# EAGLE design encoder_step2 (EAGLE 7.6.0)
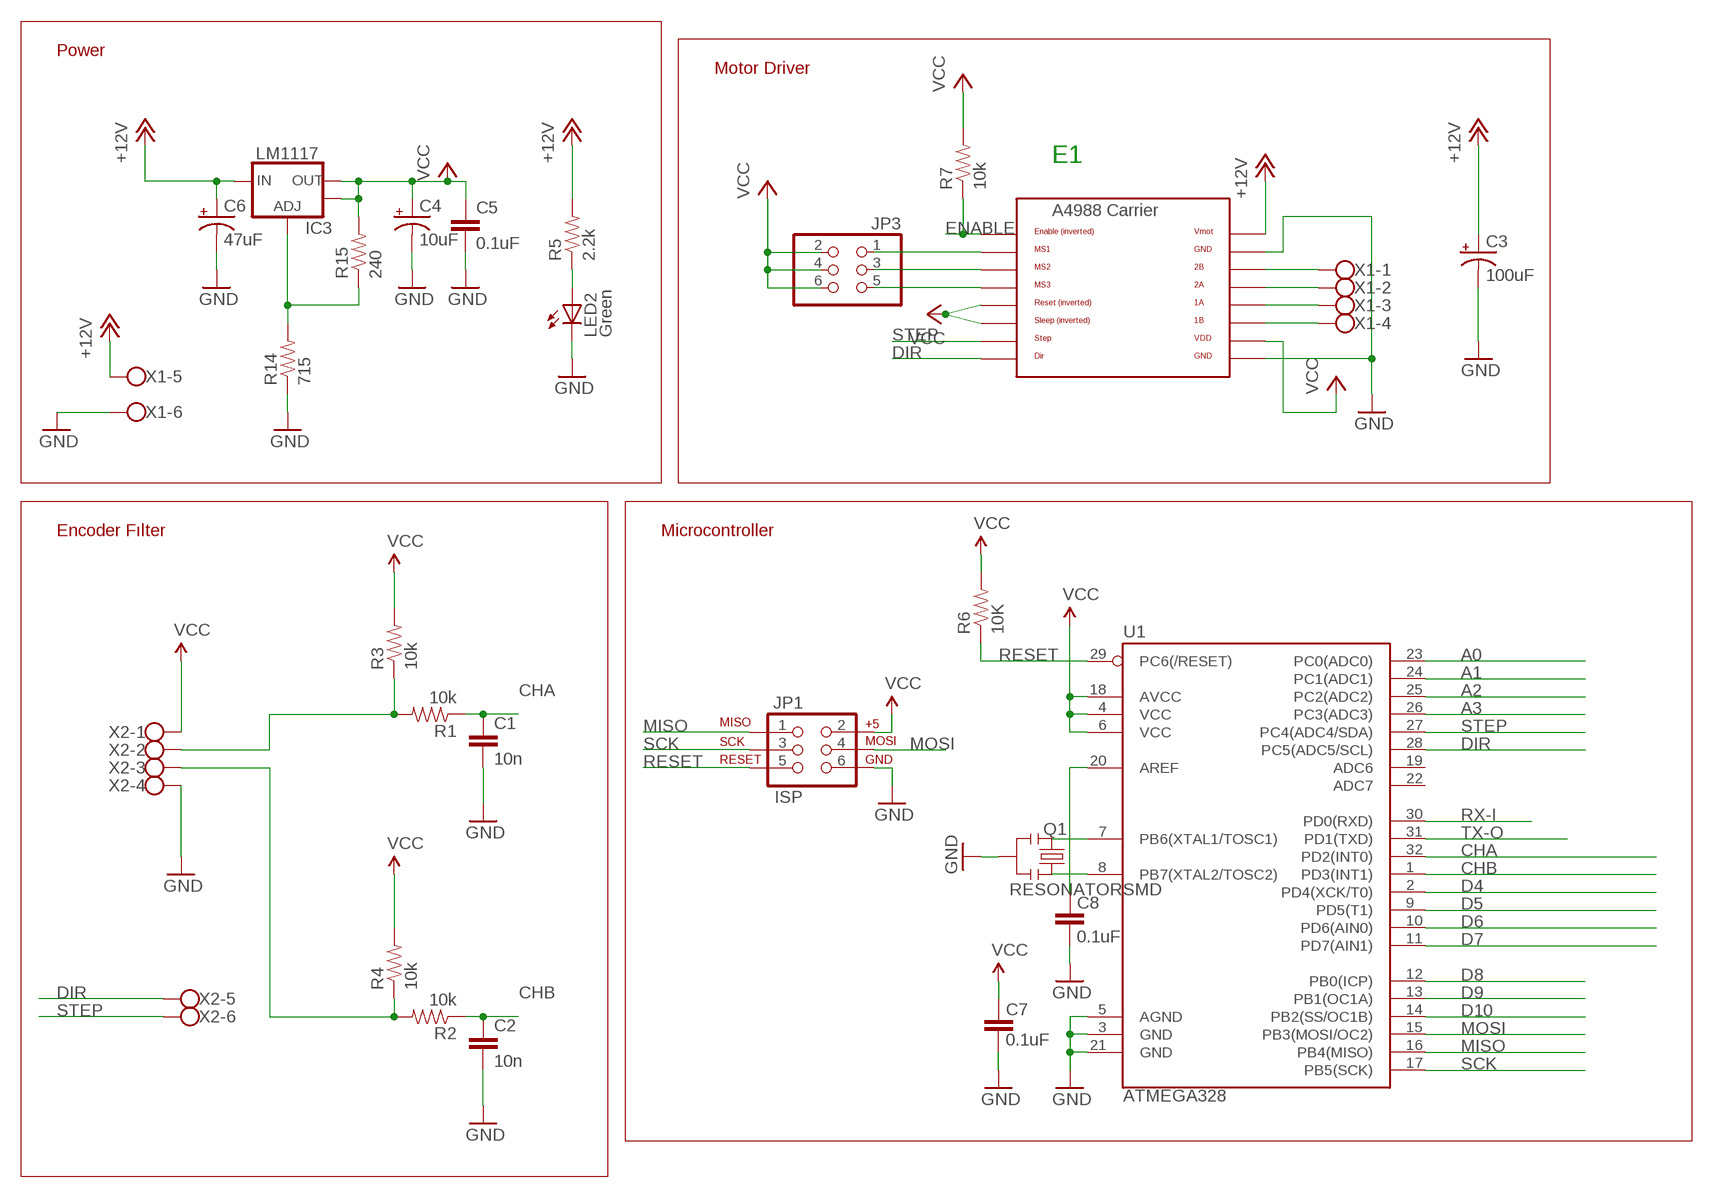
[diagram p0: schematic, sheet 1]

## Parts
C1  10n  2.2UF-25V-+80/-20(0805)  [0805]
C2  10n  2.2UF-25V-+80/-20(0805)  [0805]
C3  100uF  CPOL-US153CLV-0605  [153CLV-0605]
C4  10uF  CAP_POL1206  [EIA3216]
C5  0.1uF  CAP0805  [0805]
C6  47uF  CAP_POLD  [PANASONIC_D]
C7  0.1uF  CAP0805  [0805]
C8  0.1uF  CAP0805  [0805]
IC3  LM1117  V_REG_LM1117ALT1  [SOT223-ALT1]
JP1  ISP  AVR_SPI_PRG_6PTH  [2X3]
JP3  PINHD-2X3  [2X03]
LED2  Green  LED1206-NS  [LED-1206-NO_SILK]
Q1  RESONATORSMD  [RESONATOR-SMD]
R1  10k  RESISTOR0805-RES  [0805]
R2  10k  RESISTOR0805-RES  [0805]
R3  10k  RESISTOR0805-RES  [0805]
R4  10k  RESISTOR0805-RES  [0805]
R5  2.2k  RESISTOR0805-RES  [0805]
R6  10K  RESISTOR0805-RES  [0805]
R7  10k  RESISTOR0805-RES  [0805]
R14  715  RESISTOR0805-RES  [0805]
R15  240  RESISTOR0805-RES  [0805]
U1  ATMEGA328  ATMEGA168  [TQFP32-08]
U$5  A4988BREAKOUT  [A4988BREAKOUT]
X1  W237-6  [W237-6]
X2  W237-6  [W237-6]

## Nets
+12V [motors]: C3.+ C6.+ IC3.3(IN) R5.2 U$5.VMOT X1.5
A0: U1.23(PC0(ADC0))
A1: U1.24(PC1(ADC1))
A2: U1.25(PC2(ADC2))
A3: U1.26(PC3(ADC3))
AREF: C8.2 U1.20(AREF)
CHA: C1.1 R1.1 U1.32(PD2(INT0))
CHB: C2.1 R2.1 U1.1(PD3(INT1))
D4: U1.2(PD4(XCK/T0))
D5: U1.9(PD5(T1))
D6: U1.10(PD6(AIN0))
D7: U1.11(PD7(AIN1))
D8: U1.12(PB0(ICP))
D9: U1.13(PB1(OC1A))
D10: U1.14(PB2(SS/OC1B))
DIR: U1.28(PC5(ADC5/SCL)) U$5.DIR X2.5
ENABLE: R7.1 U$5.EN
GND: C1.2 C2.2 C3.- C4.C(-) C5.2 C6.- C7.1 C8.1 JP1.6 LED2.C Q1.2 R14.1 U1.3(GND) U1.5(AGND) U1.21(GND) U$5.GND U$5.GND@0(GND) X1.6 X2.4
MISO: JP1.1 U1.16(PB4(MISO))
MOSI: JP1.4 U1.15(PB3(MOSI/OC2))
N$1: Q1.1 U1.8(PB7(XTAL2/TOSC2))
N$2: LED2.A R5.1
N$3: R1.2 R3.1 X2.2
N$4: R2.2 R4.1 X2.3
N$5: Q1.3 U1.7(PB6(XTAL1/TOSC1))
N$12 [motors]: U$5.2B X1.1
N$13 [motors]: U$5.2A X1.2
N$15: IC3.1(ADJ) R14.2 R15.1
N$16 [motors]: U$5.1A X1.3
N$18 [motors]: U$5.1B X1.4
N$25: JP3.1 U$5.MS1
N$34: JP3.5 U$5.MS3
N$35: JP3.3 U$5.MS2
RESET: JP1.5 R6.1 U1.29(PC6(/RESET))
RX-I: U1.30(PD0(RXD))
SCK: JP1.3 U1.17(PB5(SCK))
STEP: U1.27(PC4(ADC4/SDA)) U$5.STEP X2.6
TX-O: U1.31(PD1(TXD))
VCC: C4.A(+) C5.1 C7.2 IC3.2(OUT) IC3.4(OUT) JP1.2 JP3.2 JP3.4 JP3.6 R3.2 R4.2 R6.2 R7.2 R15.2 U1.4(VCC) U1.6(VCC) U1.18(AVCC) U$5.RST U$5.SLP(SLEEP) U$5.VDD X2.1
Unconnected: U1.19(ADC6) U1.22(ADC7)

## Notes on the sheet
- Power
- Motor Driver
- E1
- Encoder Fılter | Microcontroller

## Library data of the parts
C1 C2 = SparkFun-Capacitors:2.2UF-25V-+80/-20(0805): CAP-11624; PROD_ID: CAP-11624; VALUE: 2.2uF
C3 = adafruit:CPOL-US: POLARIZED CAPACITOR, American symbol
C4 C6 = SparkFun:CAP_POL: Capacitor Polarized These are standard SMD and PTH capacitors. Normally 10uF, 47uF, and 100uF in electrolytic and tantalum varieties. Always verify the external diameter of the through hole cap, it varies with capacity, voltage, and manufacturer. The EIA devices should be standard.
C5 C7 C8 = SparkFun:CAP: Capacitor Standard 0603 ceramic capacitor, and 0.1" leaded capacitor.
IC3 = Testing:V_REG_LM1117: Voltage Regulator LM1117 Standard adjustable voltage regulator but in SMD form. Spark Fun Electronics SKU : COM-00595
JP1 = SparkFun:AVR_SPI_PRG_6: AVR ISP 6 Pin This is the reduced ISP connector for AVR programming. Common on Arduino. This footprint will take up less PCB space and can be used with a 10-pin to 6-pin adapter such as SKU: BOB-08508
JP3 = pinhead:PINHD-2X3: PIN HEADER
LED2 = SparkFun-LED:LED: LEDs Standard schematic elements and footprints for 5mm, 3mm, 1206, and 0603 sized LEDs. 5mm - Spark Fun Electronics SKU : COM-00529 (and others)
Q1 = SparkFun:RESONATOR: Resonator Small SMD resonator. This is the itty bitty 10/20MHz resonators with built in caps. CSTCE10M0G55 and CSTCE20M0V53. Footprint has been reviewed closely but hasn't been tested yet.
R1-R4 R7 = SparkFun-Passives:RESISTOR: Resistor Basic schematic elements and footprints for 0603, 1206, and PTH resistors.
R5 R6 R14 R15 = SparkFun:RESISTOR: Resistor Basic schematic elements and footprints for 0603, 1206, and PTH resistors.
U1 = SparkFun:ATMEGA168
U$5 = RepRapjr:A4988BREAKOUT
X1 X2 = con-wago-500:W237-6: WAGO SCREW CLAMP; OC_FARNELL: unknown; OC_NEWARK: unknown

## Net classes
0 default: width 0.152 mm, drill 0.305 mm, clearance 0.152 mm
1 vcc: width 0.254 mm
2 motors: width 1.016 mm

## Board
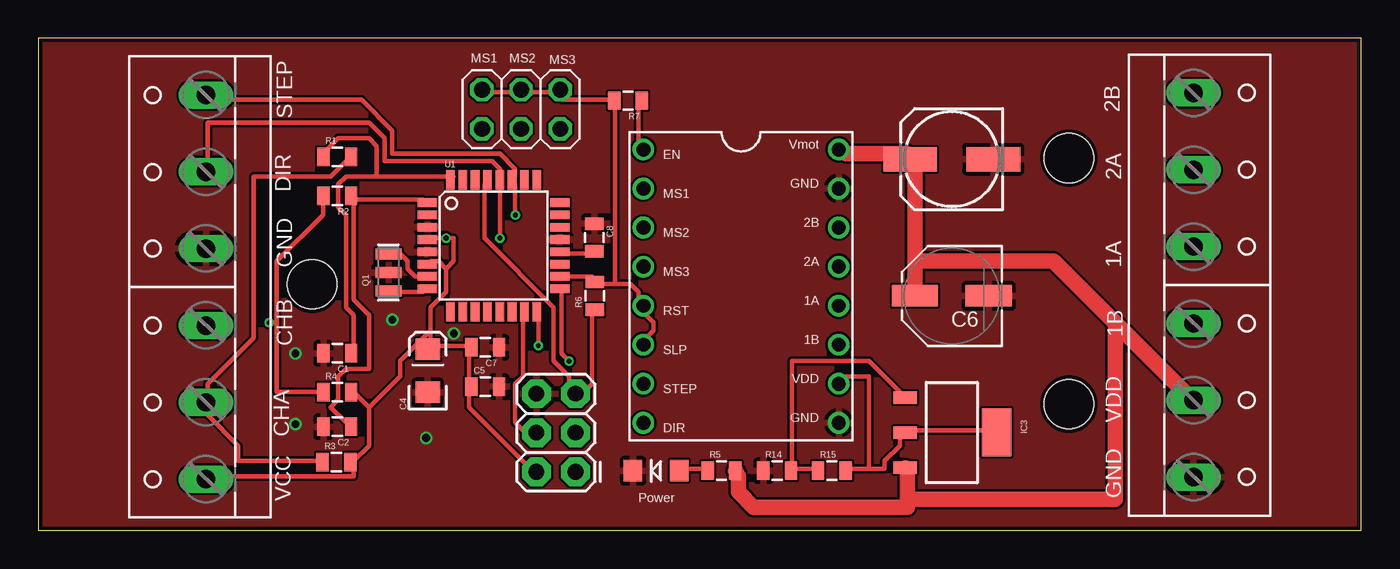
[diagram p1: board, top side]
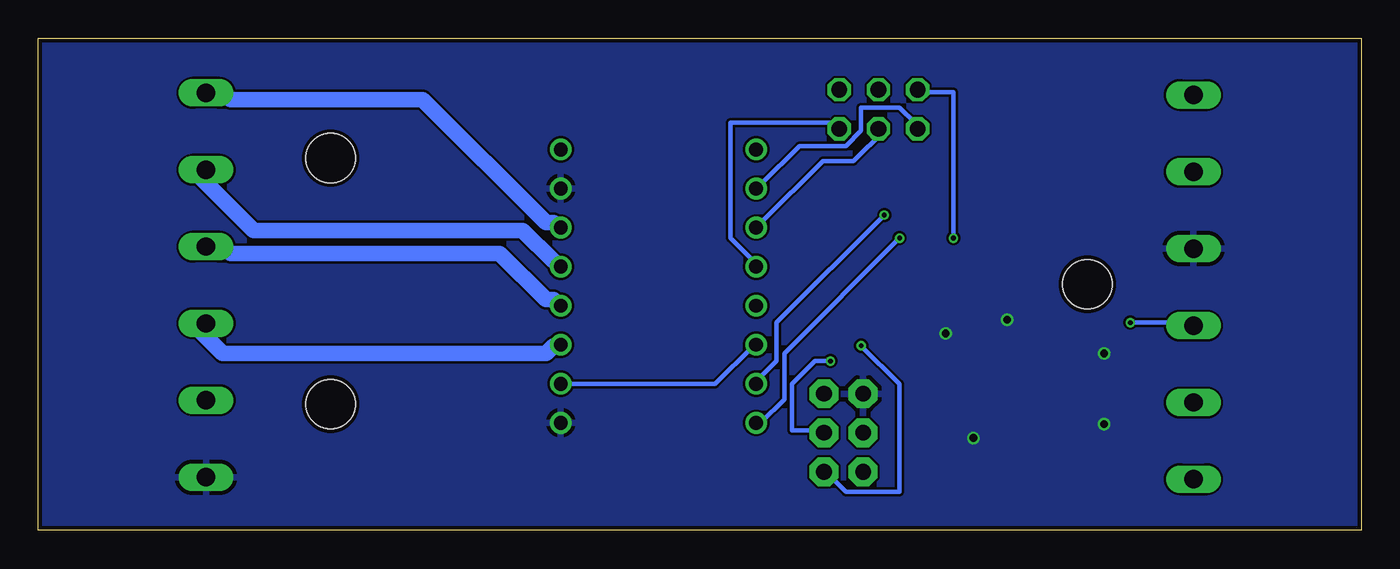
[diagram p2: board, bottom side, seen from below]

Size 85.99 x 31.99 mm. Coordinates in mm from the lower left corner, seen from the top.
Outline: 0,0 85.99,0 85.99,31.99 0,31.99 0,0
Copper layers (1*16): Top 0.035mm / dielectric 1.5mm / Bottom 0.035mm
Design rules: minimum track width 6mil, minimum drill 12mil, track to track 6mil, track to pad 6mil, pad to pad 6mil, via to via 6mil, smd to smd 0mil, copper to edge 10mil, drill to drill 10mil, minimum pad ring 10mil, minimum via ring 6mil, stop-mask expansion 2mil, vias tented up to drill 100mil, thermal gap 10mil
Holes 3.2 mm at 17.8,16 67,8.2 67,24.2

### Footprints (pad centres in the part's own frame; a part is rotated, then mirrored left to right if it is on the bottom)
0805 = smd 0.8 x 1.2: 1 -0.9,0; 2 0.9,0
153CLV-0605 = smd 3.5 x 1.6: + 2.7,0; - -2.7,0
EIA3216 = smd 1.4 x 1.6: A 1.4,0; C -1.4,0
PANASONIC_D = smd 3 x 1.4: + 2.4,0; - -2.4,0
SOT223-ALT1 = smd 0.813 x 1.524: 1 -2.271,-3.02; 2 0,-3.02; 3 2.288,-3.02 | smd 3.124 x 1.905: 4 0,2.921
2X3 = drill 1.016 pad 1.88 octagon: 1 0,0; 2 0,2.54; 3 2.54,0; 4 2.54,2.54; 5 5.08,0; 6 5.08,2.54
2X03 = drill 1.016 octagon: 1 -2.54,-1.27; 2 -2.54,1.27; 3 0,-1.27; 4 0,1.27; 5 2.54,-1.27; 6 2.54,1.27
LED-1206-NO_SILK = smd 1.2 x 1.4: A -1.5,0; C 1.5,0
RESONATOR-SMD = smd 0.7 x 1.7: 1 -1.2,0; 2 0,0; 3 1.2,0
TQFP32-08 = smd 1.27 x 0.559: 1 -4.293,2.8; 2 -4.293,2; 3 -4.293,1.2; 4 -4.293,0.4; 5 -4.293,-0.4; 6 -4.293,-1.2; 7 -4.293,-2; 8 -4.293,-2.8; 17 4.293,-2.8; 18 4.293,-2; 19 4.293,-1.2; 20 4.293,-0.4; 21 4.293,0.4; 22 4.293,1.2; 23 4.293,2; 24 4.293,2.8 | smd 0.559 x 1.27: 9 -2.8,-4.293; 10 -2,-4.293; 11 -1.2,-4.293; 12 -0.4,-4.293; 13 0.4,-4.293; 14 1.2,-4.293; 15 2,-4.293; 16 2.8,-4.293; 25 2.8,4.293; 26 2,4.293; 27 1.2,4.293; 28 0.4,4.293; 29 -0.4,4.293; 30 -1.2,4.293; 31 -2,4.293; 32 -2.8,4.293
A4988BREAKOUT = drill 0.9: 1A 8.89,1.27; 1B 11.43,1.27; 2A 6.35,1.27; 2B 3.81,1.27; DIR 16.51,-11.43; EN -1.27,-11.43; GND 16.51,1.27; GND@0 1.27,1.27; MS1 1.27,-11.43; MS2 3.81,-11.43; MS3 6.35,-11.43; RST 8.89,-11.43; SLP 11.43,-11.43; STEP 13.97,-11.43; VDD 13.97,1.27; VMOT -1.27,1.27
W237-6 = drill 1.194 long: 1 -12.5,-1.27; 2 -7.5,-1.27; 3 -2.5,-1.27; 4 2.5,-1.27; 5 7.5,-1.27; 6 12.5,-1.27

### Placement (x,y rotation side)
C1  19.43,11.51 180 top
C2  19.43,6.73 180 top
C3  59.38,24.13 180 top
C4  25.31,10.37 90 top
C5  29.05,9.35 0 top
C6  59.38,15.24 180 top
C7  29.05,11.89 180 top
C8  36.14,19.04 270 top
IC3  59.38,6.35 270 top
JP1  34.92,3.8 90 top
JP3  31.38,27.39 0 top
LED2  40.16,3.87 180 top
Q1  22.76,16.76 90 top
R1  19.43,24.29 0 top
R2  19.43,21.75 180 top
R3  19.37,4.43 0 top
R4  19.43,8.97 0 top
R5  44.41,3.87 0 top
R6  36.16,15.25 90 top
R7  38.33,27.94 180 top
R14  48.03,3.87 0 top
R15  51.59,3.87 0 top
U1  29.59,18.51 0 top
U$5  50.76,23.5 270 top
X1  76.37,15.95 270 top
X2  9.63,15.81 90 top

### Tracks (layer width: path | path; a pad name or v marks a point on that pad's centre or on a via)
+12V
  Top 1.016: 56.5,2 56.5,4 IC3.3 | 56.5,2 56.5,1.5 46.5,1.5 45.5,2.5 45.5,3.5 R5.2 | U$5.VMOT 52.5,24.5 56.5,24.5 C3.+ 57,24 57,17.5 | 57,17.5 57,15.5 C6.+ | 70.25,13.25 66,17.5 57,17.5 | 70.25,13.25 75,8.5 X1.5 | 56.5,2 70,2 70,13 70.25,13.25
AREF
  Top 0.305: C8.2 36,18 34,18 U1.20
CHA
  Top 0.305: 22,23 27,23 U1.32 | 22,23 20,23 19.5,22.5 19.5,21 20,20.5 20,14.5 20.5,14 20.5,12 C1.1 | 22,23 22,25 21.5,25.5 19.5,25.5 18.5,24.5 R1.1
CHB
  Top 0.305: 20.5,21.5 20.5,15 21.5,14 21.5,10.5 20,10.5 19.5,10 19.5,8.5 19,8 20,7 C2.1 | 20.5,21.5 25,21.5 U1.1 | 20.5,21.5 R2.1
DIR  (via drill 0.3)
  Top 0.305: X2.5 11,23.5 11,26.5 21.5,26.5 22.5,25.5 22.5,24 29.5,24 30,23.5 30,23 U1.28 30,22.5 v30,19
  Bottom 0.305: v30,19 37.5,11.5 37.5,8.5 39,7 U$5.DIR
ENABLE
  Top 0.305: R7.1 39,27.5 39,25 U$5.EN
GND  (via drill 0.5)
  other vias: 16.7,11.5 16.7,6.9 25.2,6 23,13.7 27,12.8
  pour Top: -17.8,39.9 99,40 99,-14 -17.8,-14.1
  pour Bottom: -8.2,35.7 91,35 91,-10 -8.2,-9.3
MISO  (via drill 0.3)
  Top 0.305: v32.5,12 32.5,14 U1.16
  Bottom 0.305: v32.5,12 30,9.5 30,2.5 33.5,2.5 34.5,3.5 JP1.1
MOSI
  Top 0.305: U1.15 31.5,14 31.5,10 31,9.5 31,7 32,6 JP1.4
N$1
  Top 0.305: U1.8 25,15.5 23,15.5 Q1.1
N$2
  Top 0.305: R5.1 43.5,4 42,4 LED2.A
N$3
  Top 0.305: R3.1 18.5,4.5 13,4.5 13,5.5 11,7.5 11,8 X2.2 11,8.5 11,9.5 14,12.5 14,23 19,23 20,24 R1.2
N$4  (via drill 0.3)
  Top 0.305: 15.5,13.5 15.5,17.5 18.5,20.5 18.5,21.5 R2.2 | 15.5,13.5 15.5,9 18.5,9 R4.1 | 15.5,13.5 v15,13.5
  Bottom 0.305: v15,13.5 11,13.5 X2.3
N$5
  Top 0.305: U1.7 25,16.5 24.5,16.5 24,17 24,17.5 23.5,18 23,18 Q1.3
N$12
  Bottom 1.016: U$5.2B 52.5,20 53,20 61,28 73.5,28 74,28.5 75,28.5 X1.1
N$13
  Bottom 1.016: U$5.2A 52.5,17.5 54.5,19.5 72,19.5 75.5,23 X1.2
N$15
  Top 0.305: 49,4 50.5,4 R15.1 | 49,4 49,11 54,11 56,9 IC3.1 | 49,4 R14.2
N$16
  Bottom 1.016: U$5.1A 52.5,15 53,15 56,18 73.5,18 74,18.5 75,18.5 X1.3
N$18
  Bottom 1.016: U$5.1B 52.5,12 53,11.5 74,11.5 75.5,13 X1.4
N$25
  Bottom 0.305: U$5.MS1 39,22.5 36.5,25 33.5,25 32.5,26 32.5,27.5 30,27.5 29,26.5 JP3.1
N$34
  Bottom 0.305: U$5.MS3 39.5,17.5 41,19 41,26.5 34,26.5 JP3.5
N$35
  Bottom 0.305: U$5.MS2 39,20 35,24 33,24 31,26 JP3.3
RESET
  Top 0.305: R6.1 36,14 36,9.5 35,8.5 JP1.5 34.5,9 34.5,10 33.5,11 33.5,14.5 29,19 29,22.5 U1.29
SCK  (via drill 0.3)
  Top 0.305: v34.5,11 34,11.5 34,15.5 U1.17
  Bottom 0.305: v34.5,11 35.5,11 37,9.5 37,6.5 35,6.5 JP1.3
STEP  (via drill 0.3)
  Top 0.305: X2.6 11,28 21,28 23,26 23,24.5 30,24.5 31,23.5 31,23 U1.27 31,22.5 v31,20.5
  Bottom 0.305: v31,20.5 38,13.5 38,11 39,10 U$5.STEP
VCC  (via drill 0.3)
  Top 0.305: 21.5,8 21.5,5.5 20.5,4.5 R3.2 20.5,4 20.5,3.5 11,3.5 X2.1 | 21.5,8 20.5,9 R4.2 | 26.5,17 26,17.5 25.5,17.5 U1.6 | 26.5,17 26.5,15.5 25.5,14.5 25.5,13 | 25.5,12 25.5,13 | 26.5,17 27,17.5 27,19 v26.5,19 25.5,19 U1.4 | 25.5,12 28,12 C7.2 28,11.5 28,9.5 C5.1 28,9 28,8 32,4 JP1.2 | 25.5,12 C4.A | 21.5,8 23.5,10 23.5,11 25.5,13 | JP3.2 29,28.5 31,28.5 JP3.4 31.5,28.5 33.5,28.5 JP3.6 34,28.5 34,28 37.5,28 R7.2 37.5,27.5 37.5,16 | U1.18 34,16.5 36,16.5 R6.2 36.5,16 37.5,16 | 37.5,16 38.5,16 39,15.5 39,15 U$5.RST 39.5,14.5 39.5,14 40,13.5 40,13 39.5,12.5 U$5.SLP | 54,4 55,4 55,4.5 56,5.5 56,6 IC3.2 56.5,6.5 62,6.5 IC3.4 | 54,4 52.5,4 R15.2 | 54,4 54,10 52.5,10 U$5.VDD
  Bottom 0.305: U$5.SLP 39.5,12 42,9.5 52,9.5 U$5.VDD | v26.5,19 26.5,28.5 28.5,28.5 JP3.2

### Text on the board
tNames: MS1 | MS2 | MS3 | STEP | 2B | 2A | DIR | GND | 1A | 1B | CHB | VDD | CHA | VCC | Power | GND